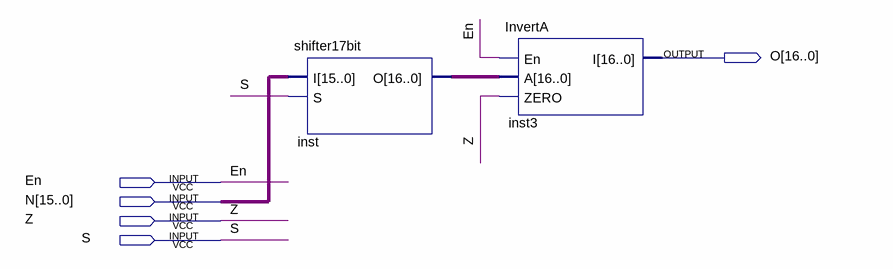
[diagram p0: schematic sheet]
// Quartus schematic BoothDB.bdf as structural Verilog: 2 symbols, 5 pins
module BoothDB (
  input  En,
  input  [15:0] N,
  input  Z,
  input  S,
  output [16:0] O
);

  wire [16:0] inst_o;

  shifter17bit inst (.I(N), .S(S), .O(inst_o));
  InvertA inst3 (.En(En), .A(inst_o), .ZERO(Z), .I(O));
endmodule
